# EAGLE schematic 555_flip_flop (EAGLE 6.2)
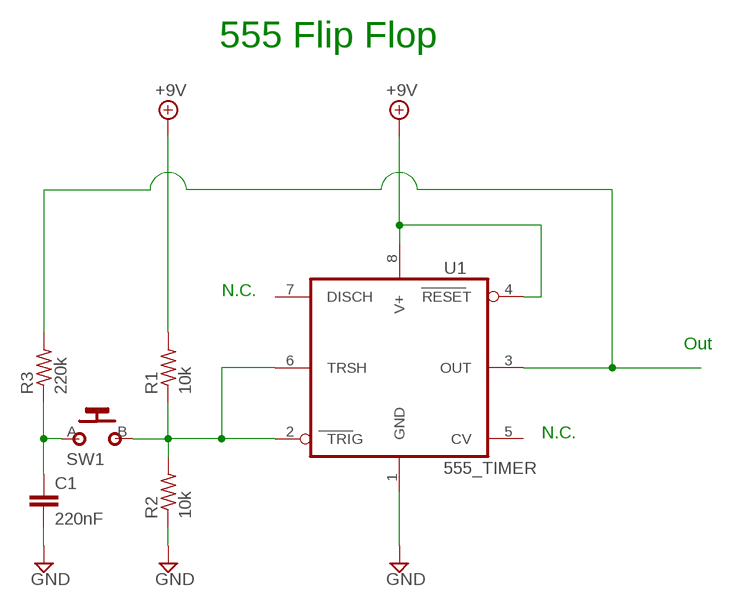
[diagram p0: schematic, sheet 1]

## Parts
C1  220nF  CERAMIC_CAPACITOR  [CERAMIC_CAP]
R1  10k  RESISTOR  [RESISTOR]
R2  10k  RESISTOR  [RESISTOR]
R3  220k  RESISTOR  [RESISTOR]
SW1  MOMENTARY_SW  [MOMENTARY_SW]
U1  555_TIMER  [DIL08]

## Nets
+9V: R1.2 U1.4(RESET) U1.8(V+)
GND: C1.2 R2.1 U1.1(GND)
N$1: R1.1 R2.2 SW1.B(S)
N$2: C1.1 R3.1 SW1.A(P)
N$7: R3.2 U1.3(OUT)
Unconnected: U1.2(TRIG) U1.5(CV) U1.6(TRSH) U1.7(DISCH)

## Notes on the sheet
- 555 Flip Flop
- N.C.
- Out
- N.C.

## Library data of the parts
C1 = 00_steve:CERAMIC_CAPACITOR
R1-R3 = 00_steve:RESISTOR
SW1 = 00_steve:MOMENTARY_SW
U1 = 00_steve:555_TIMER